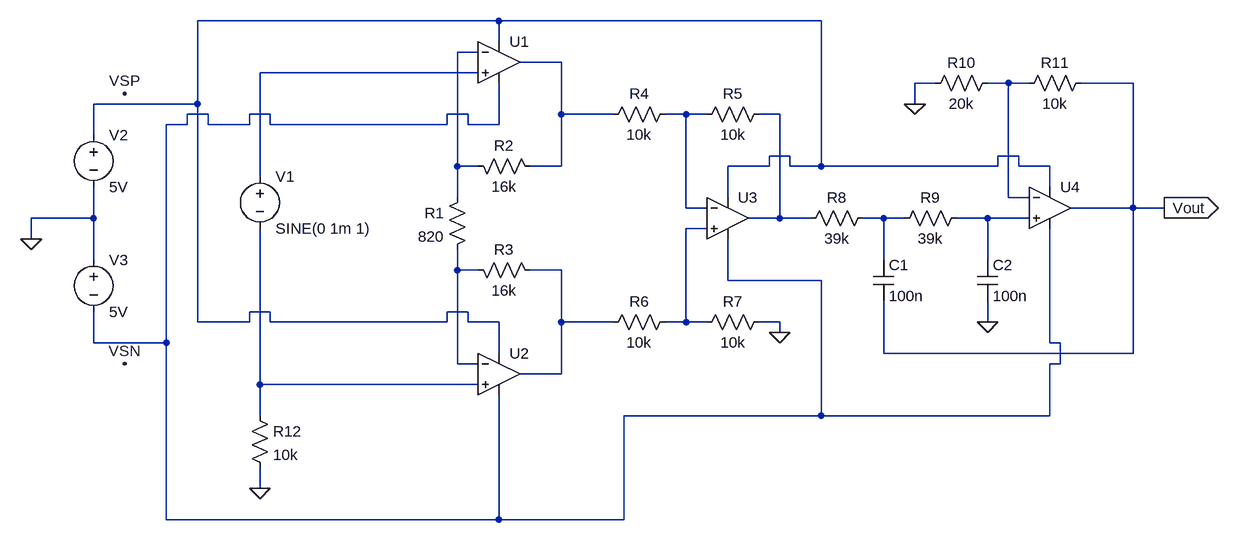
[diagram p0: schematic Proiect-2.asc]
Proiect-2.asc, the LTspice schematic file:
Version 4
SHEET 1 1584 680
WIRE 448 -128 -16 -128
WIRE 944 -128 448 -128
WIRE 448 -96 448 -128
WIRE 416 -80 384 -80
WIRE 544 -64 480 -64
WIRE 416 -48 80 -48
WIRE 1120 -32 1088 -32
WIRE 1232 -32 1200 -32
WIRE 1264 -32 1232 -32
WIRE 1424 -32 1344 -32
WIRE -16 0 -16 -128
WIRE -16 0 -176 0
WIRE 1088 0 1088 -32
WIRE 0 16 -32 16
WIRE 96 16 64 16
WIRE 400 16 368 16
WIRE 544 16 544 -64
WIRE 624 16 544 16
WIRE 736 16 704 16
WIRE 768 16 736 16
WIRE 880 16 848 16
WIRE -32 32 -32 16
WIRE -32 32 -64 32
WIRE 0 32 0 16
WIRE 64 32 64 16
WIRE 64 32 0 32
WIRE 96 32 96 16
WIRE 368 32 368 16
WIRE 368 32 96 32
WIRE 400 32 400 16
WIRE 448 32 448 -32
WIRE 448 32 400 32
WIRE -176 48 -176 0
WIRE 896 80 864 80
WIRE 1248 80 1216 80
WIRE 384 96 384 -80
WIRE 416 96 384 96
WIRE 544 96 544 16
WIRE 544 96 496 96
WIRE 864 96 864 80
WIRE 864 96 800 96
WIRE 896 96 896 80
WIRE 944 96 944 -128
WIRE 944 96 896 96
WIRE 1216 96 1216 80
WIRE 1216 96 944 96
WIRE 1248 96 1248 80
WIRE 1296 96 1248 96
WIRE 80 112 80 -48
WIRE 1296 128 1296 96
WIRE 384 144 384 96
WIRE 800 144 800 96
WIRE 1232 144 1232 -32
WIRE 1264 144 1232 144
WIRE 736 160 736 16
WIRE 768 160 736 160
WIRE 1424 160 1424 -32
WIRE 1424 160 1328 160
WIRE 1472 160 1424 160
WIRE -176 176 -176 128
WIRE -176 176 -272 176
WIRE 880 176 880 16
WIRE 880 176 832 176
WIRE 928 176 880 176
WIRE 1040 176 1008 176
WIRE 1072 176 1040 176
WIRE 1200 176 1152 176
WIRE 1264 176 1200 176
WIRE 768 192 736 192
WIRE -272 208 -272 176
WIRE -176 240 -176 176
WIRE 1040 240 1040 176
WIRE 1200 240 1200 176
WIRE 384 256 384 224
WIRE 416 256 384 256
WIRE 544 256 496 256
WIRE 800 272 800 208
WIRE 944 272 800 272
WIRE 96 320 64 320
WIRE 400 320 368 320
WIRE -16 336 -16 0
WIRE 64 336 64 320
WIRE 64 336 -16 336
WIRE 96 336 96 320
WIRE 368 336 368 320
WIRE 368 336 96 336
WIRE 400 336 400 320
WIRE 448 336 400 336
WIRE 544 336 544 256
WIRE 624 336 544 336
WIRE 736 336 736 192
WIRE 736 336 704 336
WIRE 768 336 736 336
WIRE 880 336 848 336
WIRE 1200 336 1200 304
WIRE 880 352 880 336
WIRE -176 368 -176 320
WIRE -64 368 -64 32
WIRE -64 368 -176 368
WIRE 1296 368 1296 192
WIRE 1312 368 1296 368
WIRE 448 384 448 336
WIRE 1040 384 1040 304
WIRE 1424 384 1424 160
WIRE 1424 384 1040 384
WIRE 384 400 384 256
WIRE 416 400 384 400
WIRE 1312 400 1312 368
WIRE 1312 400 1296 400
WIRE 544 416 544 336
WIRE 544 416 480 416
WIRE 80 432 80 192
WIRE 416 432 80 432
WIRE 80 480 80 432
WIRE 944 480 944 272
WIRE 944 480 640 480
WIRE 1296 480 1296 400
WIRE 1296 480 944 480
WIRE 80 592 80 560
WIRE -64 640 -64 368
WIRE 448 640 448 448
WIRE 448 640 -64 640
WIRE 640 640 640 480
WIRE 640 640 448 640
FLAG 80 592 0
FLAG 880 352 0
FLAG 1200 336 0
FLAG 1088 0 0
FLAG -272 208 0
FLAG -128 -16 VSP
FLAG -128 400 VSN
FLAG 1472 160 Vout
IOPIN 1472 160 Out
SYMBOL voltage 80 96 R0
WINDOW 123 0 0 Left 0
WINDOW 39 0 0 Left 0
SYMATTR InstName V1
SYMATTR Value SINE(0 1m 1)
SYMBOL res 64 464 R0
SYMATTR InstName R12
SYMATTR Value 10k
SYMBOL res 400 128 M0
SYMATTR InstName R1
SYMATTR Value 820
SYMBOL res 400 80 M90
WINDOW 0 0 56 VBottom 2
WINDOW 3 32 56 VTop 2
SYMATTR InstName R2
SYMATTR Value 16k
SYMBOL res 400 240 M90
WINDOW 0 0 56 VBottom 2
WINDOW 3 32 56 VTop 2
SYMATTR InstName R3
SYMATTR Value 16k
SYMBOL res 720 0 R90
WINDOW 0 0 56 VBottom 2
WINDOW 3 32 56 VTop 2
SYMATTR InstName R4
SYMATTR Value 10k
SYMBOL res 720 320 R90
WINDOW 0 0 56 VBottom 2
WINDOW 3 32 56 VTop 2
SYMATTR InstName R6
SYMATTR Value 10k
SYMBOL res 864 0 R90
WINDOW 0 0 56 VBottom 2
WINDOW 3 32 56 VTop 2
SYMATTR InstName R5
SYMATTR Value 10k
SYMBOL res 864 320 R90
WINDOW 0 0 56 VBottom 2
WINDOW 3 32 56 VTop 2
SYMATTR InstName R7
SYMATTR Value 10k
SYMBOL res 1024 160 R90
WINDOW 0 0 56 VBottom 2
WINDOW 3 32 56 VTop 2
SYMATTR InstName R8
SYMATTR Value 39k
SYMBOL res 1168 160 R90
WINDOW 0 0 56 VBottom 2
WINDOW 3 32 56 VTop 2
SYMATTR InstName R9
SYMATTR Value 39k
SYMBOL cap 1024 240 R0
SYMATTR InstName C1
SYMATTR Value 100n
SYMBOL cap 1184 240 R0
SYMATTR InstName C2
SYMATTR Value 100n
SYMBOL res 1360 -48 R90
WINDOW 0 0 56 VBottom 2
WINDOW 3 32 56 VTop 2
SYMATTR InstName R11
SYMATTR Value 10k
SYMBOL res 1216 -48 R90
WINDOW 0 0 56 VBottom 2
WINDOW 3 32 56 VTop 2
SYMATTR InstName R10
SYMATTR Value 20k
SYMBOL voltage -176 32 R0
SYMATTR InstName V2
SYMATTR Value 5V
SYMBOL voltage -176 224 R0
SYMATTR InstName V3
SYMATTR Value 5V
SYMBOL OpAmps\\UniversalOpAmp2 448 -64 R0
SYMATTR InstName U1
SYMBOL OpAmps\\UniversalOpAmp2 448 416 R0
SYMATTR InstName U2
SYMBOL OpAmps\\UniversalOpAmp2 800 176 R0
SYMATTR InstName U3
SYMBOL OpAmps\\UniversalOpAmp2 1296 160 R0
SYMATTR InstName U4

The netlist it stands for:
* Proiect-2.asc
V1 N004 N014 SINE(0 1m 1)
R12 N014 0 10k
R1 N002 N012 820
R2 N002 N003 16k
R3 N012 N013 16k
R4 N007 N003 10k
R6 N011 N013 10k
R5 N008 N007 10k
R7 0 N011 10k
R8 N009 N008 39k
R9 N010 N009 39k
C1 N009 Vout 100n
C2 N010 0 100n
R11 Vout N005 10k
R10 N005 0 20k
V2 N001 0 5V
V3 0 N006 5V
XU1 N004 N002 N001 N006 N003 level2 Avol=1Meg GBW=10Meg Slew=10Meg Ilimit=25m Rail=0 Vos=0 En=0 Enk=0 In=0 Ink=0 Rin=500Meg  ; pins In+ In- V+ V- OUT
XU2 N014 N012 N001 N006 N013 level2 Avol=1Meg GBW=10Meg Slew=10Meg Ilimit=25m Rail=0 Vos=0 En=0 Enk=0 In=0 Ink=0 Rin=500Meg  ; pins In+ In- V+ V- OUT
XU3 N011 N007 N001 N006 N008 level2 Avol=1Meg GBW=10Meg Slew=10Meg Ilimit=25m Rail=0 Vos=0 En=0 Enk=0 In=0 Ink=0 Rin=500Meg  ; pins In+ In- V+ V- OUT
XU4 N010 N005 N001 N006 Vout level2 Avol=1Meg GBW=10Meg Slew=10Meg Ilimit=25m Rail=0 Vos=0 En=0 Enk=0 In=0 Ink=0 Rin=500Meg  ; pins In+ In- V+ V- OUT
.lib UniversalOpAmp2.lib
.backanno
.end